# Altium schematic sheet HandPcb.SchDoc
size A4; SheetNumber: 1; SheetTotal: 1
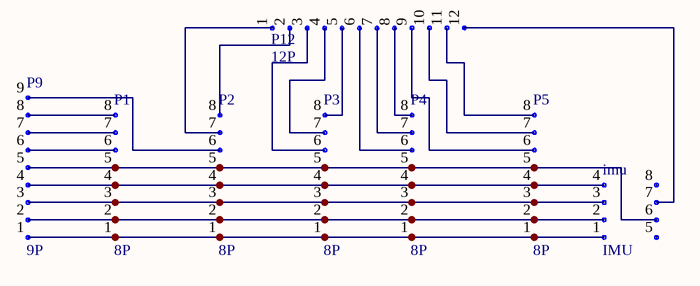
[diagram p0: HandPcb.SchDoc]

## Parts
imu  IMU  [MPU9250]
P1  8P  [8P]
P2  8P  [8P]
P3  8P  [8P]
P4  8P  [8P]
P5  8P  [8P]
P9  9P  [9p]
P12  12P  [12P]

## Nets
Netimu_1: imu.1 P1.1 P2.1 P3.1 P4.1 P5.1 P9.1
Netimu_2: imu.2 P1.2 P2.2 P3.2 P4.2 P5.2 P9.2
Netimu_3: imu.3 P1.3 P2.3 P3.3 P4.3 P5.3 P9.3
Netimu_4: imu.4 P1.4 P2.4 P3.4 P4.4 P5.4 P9.4
Netimu_6: imu.6 P1.5 P2.5 P3.5 P4.5 P5.5 P9.5
Netimu_7: imu.7 P12.12
NetP1_6: P1.6 P9.6
NetP1_7: P1.7 P9.7
NetP1_8: P1.8 P9.8
NetP2_6: P2.6 P9.9
NetP2_7: P2.7 P12.1
NetP2_8: P2.8 P12.2
NetP3_6: P3.6 P12.3
NetP3_7: P3.7 P12.4
NetP3_8: P3.8 P12.5
NetP4_6: P4.6 P12.6
NetP4_7: P4.7 P12.7
NetP4_8: P4.8 P12.8
NetP5_6: P5.6 P12.9
NetP5_7: P5.7 P12.10
NetP5_8: P5.8 P12.11

Not connected (* = marked no-connect by the designer): imu 5 8